# Altium schematic sheet PCB_BLU2.SchDoc
size A4
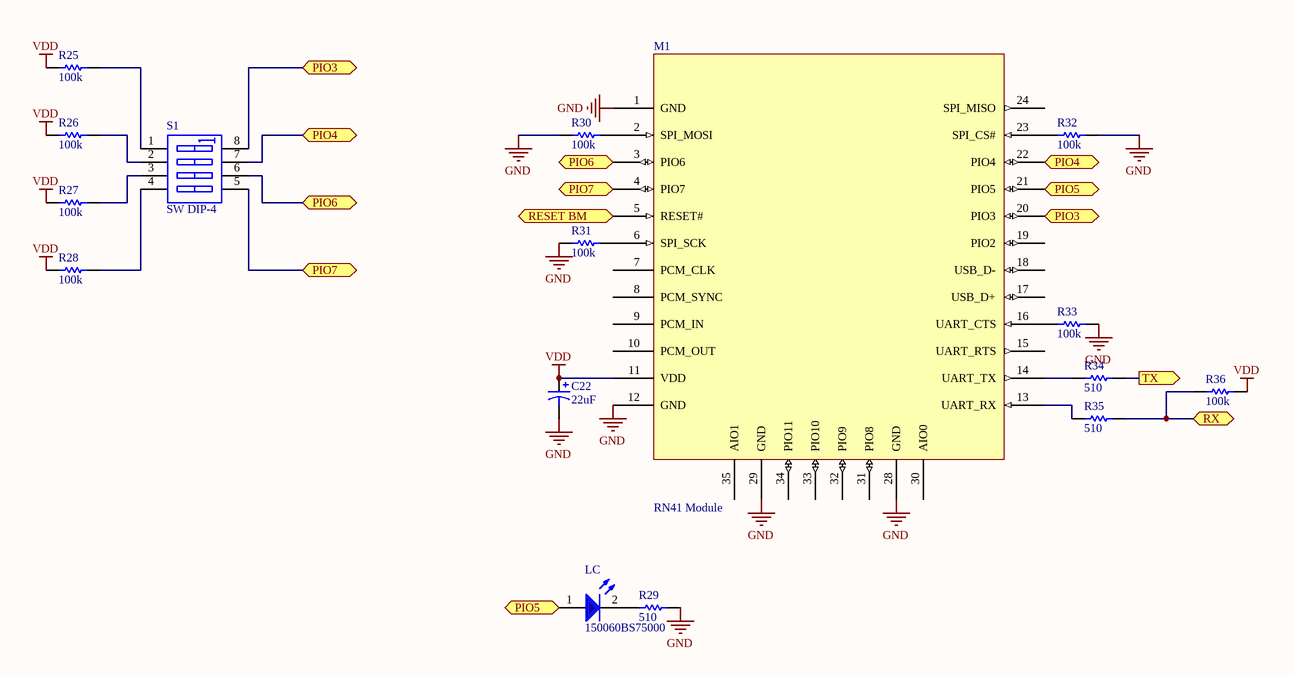
[diagram p0: PCB_BLU2.SchDoc]

## Parts
C22  22uF  [6032]
LC  150060BS75000  [LED_0603_Blue]
M1  RN41 Module  [RN42-LAND]
R25  100k  [RES0402R]
R26  100k  [RES0402R]
R27  100k  [RES0402R]
R28  100k  [RES0402R]
R29  510  [RES0402R]
R30  100k  [RES0201R]
R31  100k  [RES0201R]
R32  100k  [RES0201R]
R33  100k  [RES0201R]
R34  510  [RES0201R]
R35  510  [RES0201R]
R36  100k  [RES0201R]
S1  SW DIP-4  [SO8_N]

## Ports
PIO3 (bidir), PIO4 (bidir), PIO5 (bidir), PIO6 (bidir), PIO7 (bidir), RESET BM (bidir), RX (bidir), TX (out)

## Nets
GND: C22.2 M1.1(GND) M1.12(GND) M1.28(GND) M1.29(GND) R29.2 R30.2 R31.2 R32.1 R33.1
VDD: C22.1 M1.11(VDD) R25.2 R26.2 R27.2 R28.2 R36.1
PIO3: M1.20(PIO3) S1.8(B1) ; port PIO3
PIO4: M1.22(PIO4) S1.7(B2) ; port PIO4
PIO5: LC.1(A) M1.21(PIO5) ; port PIO5
PIO6: M1.3(PIO6) S1.6(B3) ; port PIO6
PIO7: M1.4(PIO7) S1.5(B4) ; port PIO7
RESET BM: M1.5(RESET#) ; port RESET BM
RX: R35.1 R36.2 ; port RX
TX: R34.1 ; port TX
NetLC_2: LC.2(C) R29.1
NetM1_2: M1.2(SPI_MOSI) R30.1
NetM1_6: M1.6(SPI_SCK) R31.1
NetM1_13: M1.13(UART_RX) R35.2
NetM1_14: M1.14(UART_TX) R34.2
NetM1_16: M1.16(UART_CTS) R33.2
NetM1_23: M1.23(SPI_CS#) R32.2
NetR25_1: R25.1 S1.1(A1)
NetR26_1: R26.1 S1.2(A2)
NetR27_1: R27.1 S1.3(A3)
NetR28_1: R28.1 S1.4(A4)

Not connected (* = marked no-connect by the designer): M1 7(PCM_CLK) 8(PCM_SYNC) 9(PCM_IN) 10(PCM_OUT) 15(UART_RTS) 17(USB_D+) 18(USB_D-) 19(PIO2) 24(SPI_MISO) 30(AIO0) 31(PIO8) 32(PIO9) 33(PIO10) 34(PIO11) 35(AIO1)

## Library data of the parts
C22 = CWR11DH226M: Tantamount Military, Surface Mount MIL-PRF-55365/8 Qualified Solid Tantalum Chip Capacitor: 22uF, 20% Tolerance, 6 WVDC @ +85°C, Surge = 8V; Note: See Data Sheet for full range of components; Published: 19-Mar-2004; DatasheetDocument: 20-Mar-2003; PackageReference: 6032; Publisher: Altium Limited; Code_JEITA: 6032; ComponentLink1Description: Manufacturer Link; ComponentLink1URL: http://www.vishay.com/; ComponentLink2Description: Datasheet; ComponentLink2URL: http://www.vishay.com/docs/40011/cwr11.pdf; Value: 22uF
LC = WL-SMCW 0603  150060BS75000: SMD mono-color Chip LED, WL-SMCW, Blue; Manufacturer: W黵th Elektronik eiSos GmbH; PartNo: 150060BS75000; ComponentLink1Description: Manufacturer; ComponentLink1URL: http://www.we-online.de; Created by: Christin Otto; Created Date: June 2013; ComponentLink2Description: Datasheet; ComponentLink2URL: http://katalog.we-online.com/led/datasheet/150060BS75000.pdf; Color: Blue
M1 = RN42MOD: RN41-I/RM; Value: RN42
R25-R36 = Resistor1: Resistor; Value: =Value
S1 = SW DIP-4: DIP Switch, 4 Position, SPST; Published: 24-Mar-1999; LatestRevisionDate: 29-May-2009; LatestRevisionNote: IPC-7351 Footprint Added.; PackageVersion: Dec-2002; PackageReference: SO8; Publisher: Altium Limited; PackageDescription: 8-Pin Small Outline Integrated Circuit 1.27 mm Pitch; Code_JEDEC: MS-012-AA; Code_IPC: SOIC127P600-8